# Altium project ESP32_Projet.PrjPcb
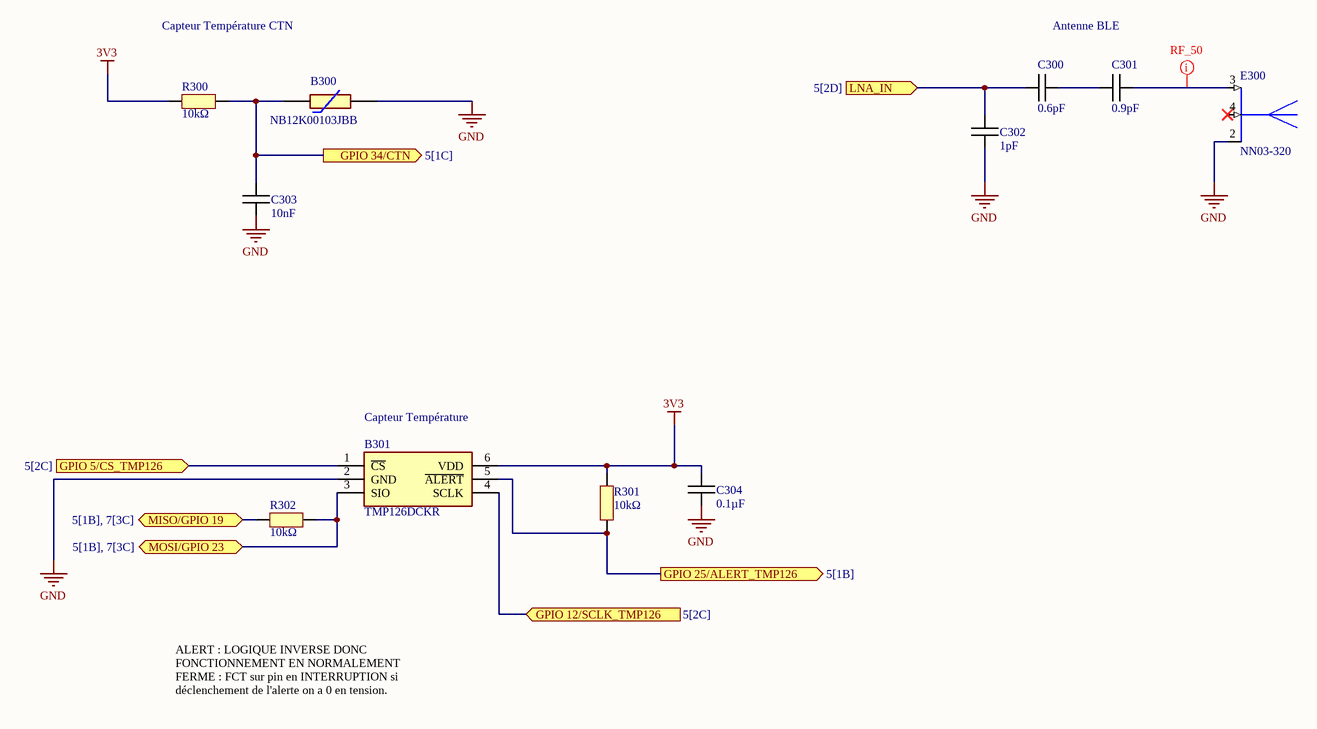
[diagram p0: Capteurs_et_Antenne.SchDoc]
7 sheets, 98 parts. Net scope: flat (ports and power ports of the same name join across sheets).
Board file: PCB_V_A_0.PcbDoc
Sheets:
  Capteurs_et_Antenne.SchDoc
  Converti_Alim.SchDoc
  Logique_Prio_Alim.SchDoc
  IHM.SchDoc
  ESP32_SRAM.SchDoc
  USB.SchDoc
  I2C.SchDoc

## Sheet Capteurs_et_Antenne.SchDoc: CAPTEURS ET ANTENNE BLUETOOTH
size A4; CheckedBy: P. FISCHER; Author: Y. NAIT et P. FISCHER; CompanyName: LE GROUPE DE 5; DrawnBy: Y. NAIT et P. FISCHER; DocumentNumber: SCH_CARTE_MONITORING_PERMANENT_0; Revision: A.0; SheetNumber: 3; SheetTotal: 7

### Parts
B300  NB12K00103JBB  [RESC2212X50N]
B301  TMP126DCKR  [SOT65P210X110-6N]
C300  0.6pF  [CAPC1005X06N]
C301  0.9pF  [CAPC1005X06N]
C302  1pF  [CAPC1005X06N]
C303  10nF  [CAPC1005X06N]
C304  0.1µF  [CAPC1005X06N]
E300  NN03-320  [XCVR_NN03-320]
R300  10kΩ  [RESC1005X06N]
R301  10kΩ  [RESC1005X06N]
R302  10kΩ  [RESC1005X06N]

### Ports
GPIO 5/CS_TMP126 (in, see 5[2C]), GPIO 12/SCLK_TMP126 (in, see 5[2C]), GPIO 25/ALERT_TMP126 (out, see 5[1B]), GPIO 34/CTN (out, see 5[1C]), LNA_IN (in, see 5[2D]), MISO/GPIO 19 (bidir, see 5[1B], 7[3C]), MOSI/GPIO 23 (bidir, see 5[1B], 7[3C])

### Nets
3V3: B301.6(VDD) C304.1 R300.1 R301.2
GND: B300.2 B301.2(GND) C302.1 C303.2 C304.2 E300.2(GROUND)
NetB300_1: B300.1 C303.1 R300.2 ; port GPIO 34/CTN
NetB301_1: B301.1(~{CS}) ; port GPIO 5/CS_TMP126
NetB301_3: B301.3(SIO) R302.2 ; port MOSI/GPIO 23
NetB301_4: B301.4(SCLK) ; port GPIO 12/SCLK_TMP126
NetB301_5: B301.5(~{ALERT}) R301.1 ; port GPIO 25/ALERT_TMP126
NetC300_1: C300.1 C301.1
NetC300_2: C300.2 C302.2 ; port LNA_IN
NetC301_2: C301.2 E300.3(FEED_BLUETOOTH)
NetJ700_5: R302.1 ; port MISO/GPIO 19

Not connected (* = marked no-connect by the designer): E300 4(FEED_GNSS)*

### Layout directives
rule Width Constraint [Pref Impedance = 50.00ohms    Min Impedance = 50.00ohms    Max Impedance = 50.00ohms]: NetC301_2

### Notes on the sheet
- Capteur Température CTN
- Antenne BLE
- (near B301) Capteur Température
- ALERT : LOGIQUE INVERSE DONC FONCTIONNEMENT EN NORMALEMENT FERME : FCT sur pin en INTERRUPTION si déclenchement de l'alerte on a 0 en tension.

### Library data of the parts
B300 = NB12K00103JBB: CTN Capteur - NTC SMD Thermistor, NB12K, 10K, 5% AVX 10k 0805 Protection NTC Thermistor, 5s, 2 x 1.25 x 1.3mm; Manufacturer_Name: Kyocera AVX; Geometry.Height: 0.5mm; Manufacturer_Part_Number: NB12K00103JBB; Mouser Part Number: 581-NB12K00103JBB; Mouser Price/Stock: https://www.mouser.co.uk/ProductDetail/AVX/NB12K00103JBB/?qs=4%252B6%252BTdINQeDPvI%252BQUQjJ3Q%3D%3D; Arrow Part Number: NB12K00103JBB; Arrow Price/Stock: https://www.arrow.com/en/products/nb12k00103jbb/avx; Datasheet Link: https://datasheet.datasheetarchive.com/originals/distributors/Datasheets-DGA6/551314.pdf
B301 = TMP126DCKR: Board Mount Temperature Sensors +/-0.25 C SPI temperature sensor with 175 C operation, CRC and slew-rate alert; Manufacturer_Name: Texas Instruments; Manufacturer_Part_Number: TMP126DCKR; Mouser Part Number: 595-TMP126DCKR
C300-C304 = Capacitor
E300 = NN03-320: Dual port antenna booster for GNSS, Bluetooth, 5G and UWB (1561 - 1606MHz, 2400 - 2500MHz, 3400 - 3800MHz, 3100 - 4800MHz and 6000 - 10600 MHz), signal booster; Manufacturer_Name: Ignion; Manufacturer_Part_Number: NN03-320; Mouser Part Number: 128-NN03-320
R300-R302 = Resistor

## Sheet Converti_Alim.SchDoc: CONVERSION DES ALIMENTATIONS D'ENTREES
size A4; Date: 26/04/2026; CheckedBy: P. FISCHER; Author: P. FISCHER; CompanyName: LE GROUPE DE 5; DrawnBy: P. FISCHER; DocumentNumber: SCH_CARTE_MONITORING_PERMANENT_0; Revision: A.0; SheetNumber: 1; SheetTotal: 7
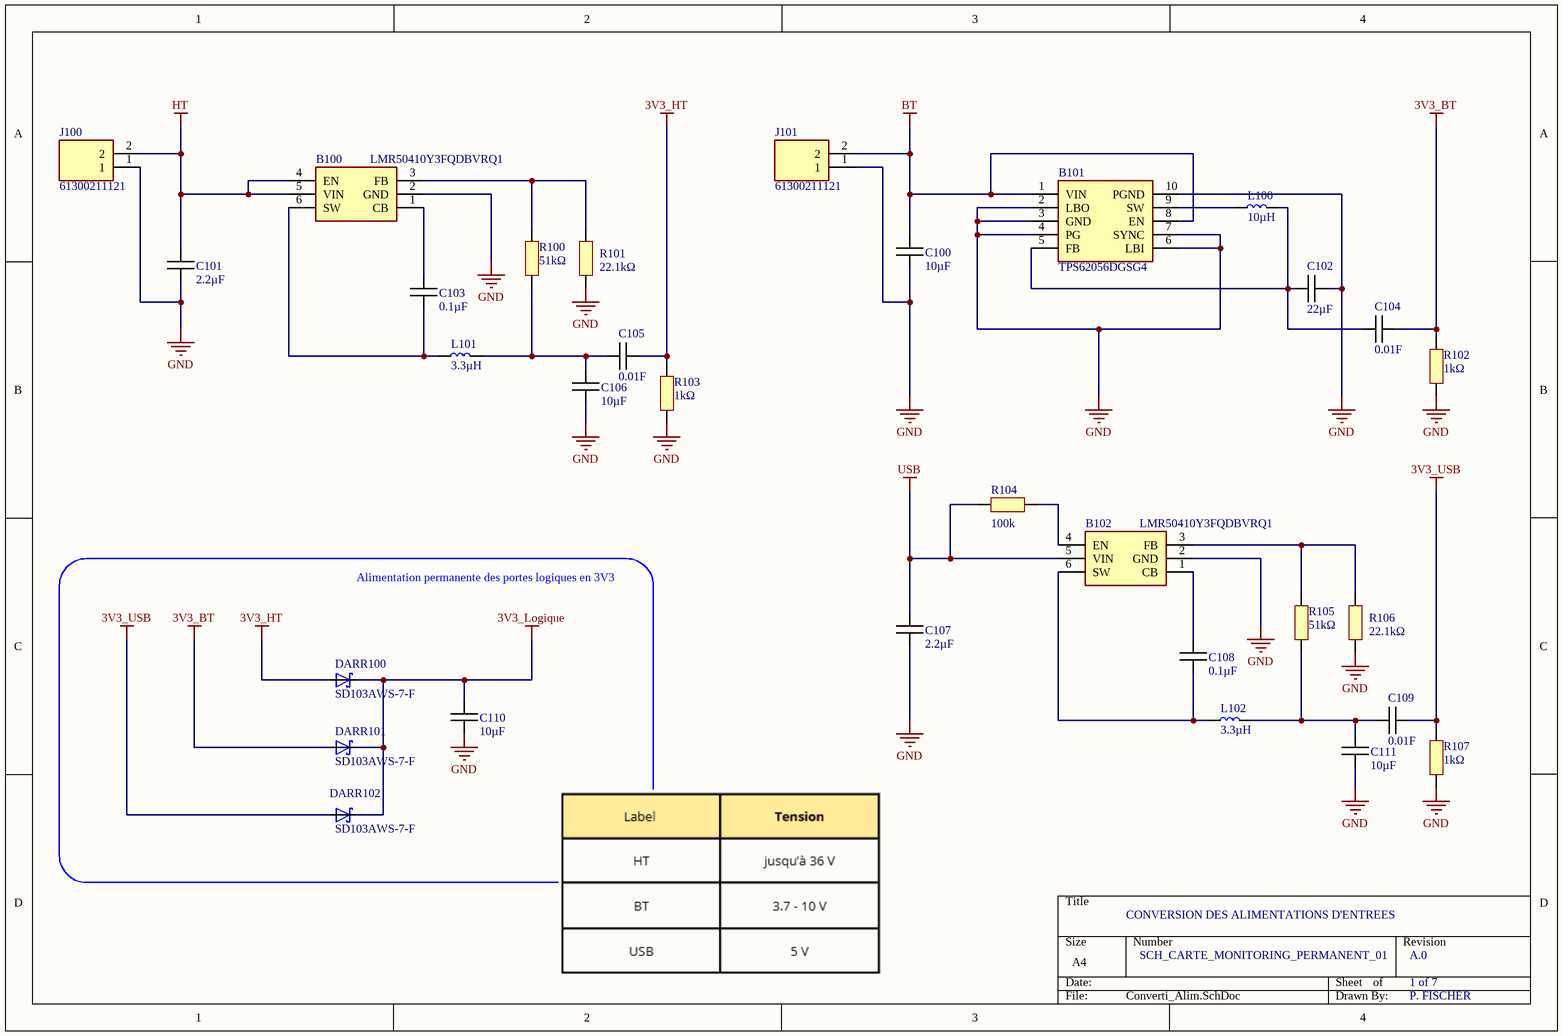
[diagram p1: Converti_Alim.SchDoc]

### Parts
B100  LMR50410Y3FQDBVRQ1  [SOT95P280X145-6N]
B101  TPS62056DGSG4  [SOP50P490X110-10N]
B102  LMR50410Y3FQDBVRQ1  [SOT95P280X145-6N]
C100  10µF  [CAPC1005X06N]
C101  2.2µF  [CAPC1005X06N]
C102  22µF  [CAPC1005X06N]
C103  0.1µF  [CAPC1005X06N]
C104  0.01F  [CAPC1005X06N]
C105  0.01F  [CAPC1005X06N]
C106  10µF  [CAPC1005X06N]
C107  2.2µF  [CAPC1005X06N]
C108  0.1µF  [CAPC1005X06N]
C109  0.01F  [CAPC1005X06N]
C110  10µF  [CAPC1005X06N]
C111  10µF  [CAPC1005X06N]
DARR100  SD103AWS-7-F  [SD103AWS-7-F]
DARR101  SD103AWS-7-F  [SD103AWS-7-F]
DARR102  SD103AWS-7-F  [SD103AWS-7-F]
J100  61300211121  [61300211121]
J101  61300211121  [61300211121]
L100  10µH  [LQPC1005X06N]
L101  3.3µH  [LQPC1005X06N]
L102  3.3µH  [LQPC1005X06N]
R100  51kΩ  [RESC1005X06N]
R101  22.1kΩ  [RESC1005X06N]
R102  1kΩ  [RESC1005X06N]
R103  1kΩ  [RESC1005X06N]
R104  100k  [RESC1005X06N]
R105  51kΩ  [RESC1005X06N]
R106  22.1kΩ  [RESC1005X06N]
R107  1kΩ  [RESC1005X06N]

### Blocks framed on the sheet
Alimentation permanente des portes logiques en 3V3: C110 DARR100-DARR102

### Nets
3V3_BT: C104.2 DARR101.2(A) R102.2
3V3_HT: C105.2 DARR100.2(A) R103.2
3V3_Logique: C110.1 DARR100.1(C) DARR101.1(C) DARR102.1(C)
3V3_USB: C109.2 DARR102.2(A) R107.2
BT: B101.1(VIN) B101.8(EN) C100.1 J101.2
GND: B100.2(GND) B101.2(LBO) B101.3(GND) B101.4(PG) B101.6(LBI) B101.7(SYNC) B101.10(PGND) B102.2(GND) C100.2 C101.2 C102.2 C106.2 C107.2 C110.2 C111.2 J100.1 J101.1 R101.1 R102.1 R103.1 R106.1 R107.1
HT: B100.4(EN) B100.5(VIN) C101.1 J100.2
USB: B102.5(VIN) C107.1 R104.1
NetB100_1: B100.1(CB) C103.1
NetB100_3: B100.3(FB) R100.2 R101.2
NetB100_6: B100.6(SW) C103.2 L101.1
NetB101_5: B101.5(FB) C102.1 C104.1 L100.2
NetB101_9: B101.9(SW) L100.1
NetB102_1: B102.1(CB) C108.1
NetB102_3: B102.3(FB) R105.2 R106.2
NetB102_4: B102.4(EN) R104.2
NetB102_6: B102.6(SW) C108.2 L102.1
NetC105_1: C105.1 C106.1 L101.2 R100.1
NetC109_1: C109.1 C111.1 L102.2 R105.1

### Library data of the parts
B100 B102 = LMR50410Y3FQDBVRQ1: Régulateurs de tension de commutation Automotive qualified SIMPLE SWITCHER 4-V to 36-V, 1-A synchronous step-down converter 6-SOT-23 -40 to 150; Manufacturer_Name: Texas Instruments; Manufacturer_Part_Number: LMR50410Y3FQDBVRQ1; Mouser Part Number: 595-R50410Y3FQDBVRQ1
B101 = TPS62056DGSG4: TEXAS INSTRUMENTS - TPS62056DGSG4 - Synchronous Buck (Step Down) Switching Regulator, Fixed, 2.7V-10Vin, 3.3V/0.8A out, 850kHz, VSSOP-10; Manufacturer_Name: Texas Instruments; Manufacturer_Part_Number: TPS62056DGSG4; Mouser Part Number: 595-TPS62056DGSG4
C100-C111 = Capacitor
DARR100-DARR102 = SD103AWS-7-F: Diode Array 3 Independent Schottky 40V 175mA Surface Mount 6-TSSOP, SC-88, SOT-363
J100 J101 = 61300211121: WURTH ELEKTRONIK - 61300211121 - HEADER, 2.54MM, PIN, THT, VERTICAL, 2WAY
L100-L102 = Bobine
R100-R107 = Resistor

## Sheet Logique_Prio_Alim.SchDoc: LOGIQUE DE GESTION DES PRIORITES DES ALIMENTATIONS
size A4; Date: 14/04/2026; CheckedBy: P. FISCHER; Author: P. FISCHER; CompanyName: LE GROUPE DE 5; DrawnBy: P. FISCHER; DocumentNumber: SCH_CARTE_MONITORING_PERMANENT_0; Revision: A.0; SheetNumber: 2; SheetTotal: 7
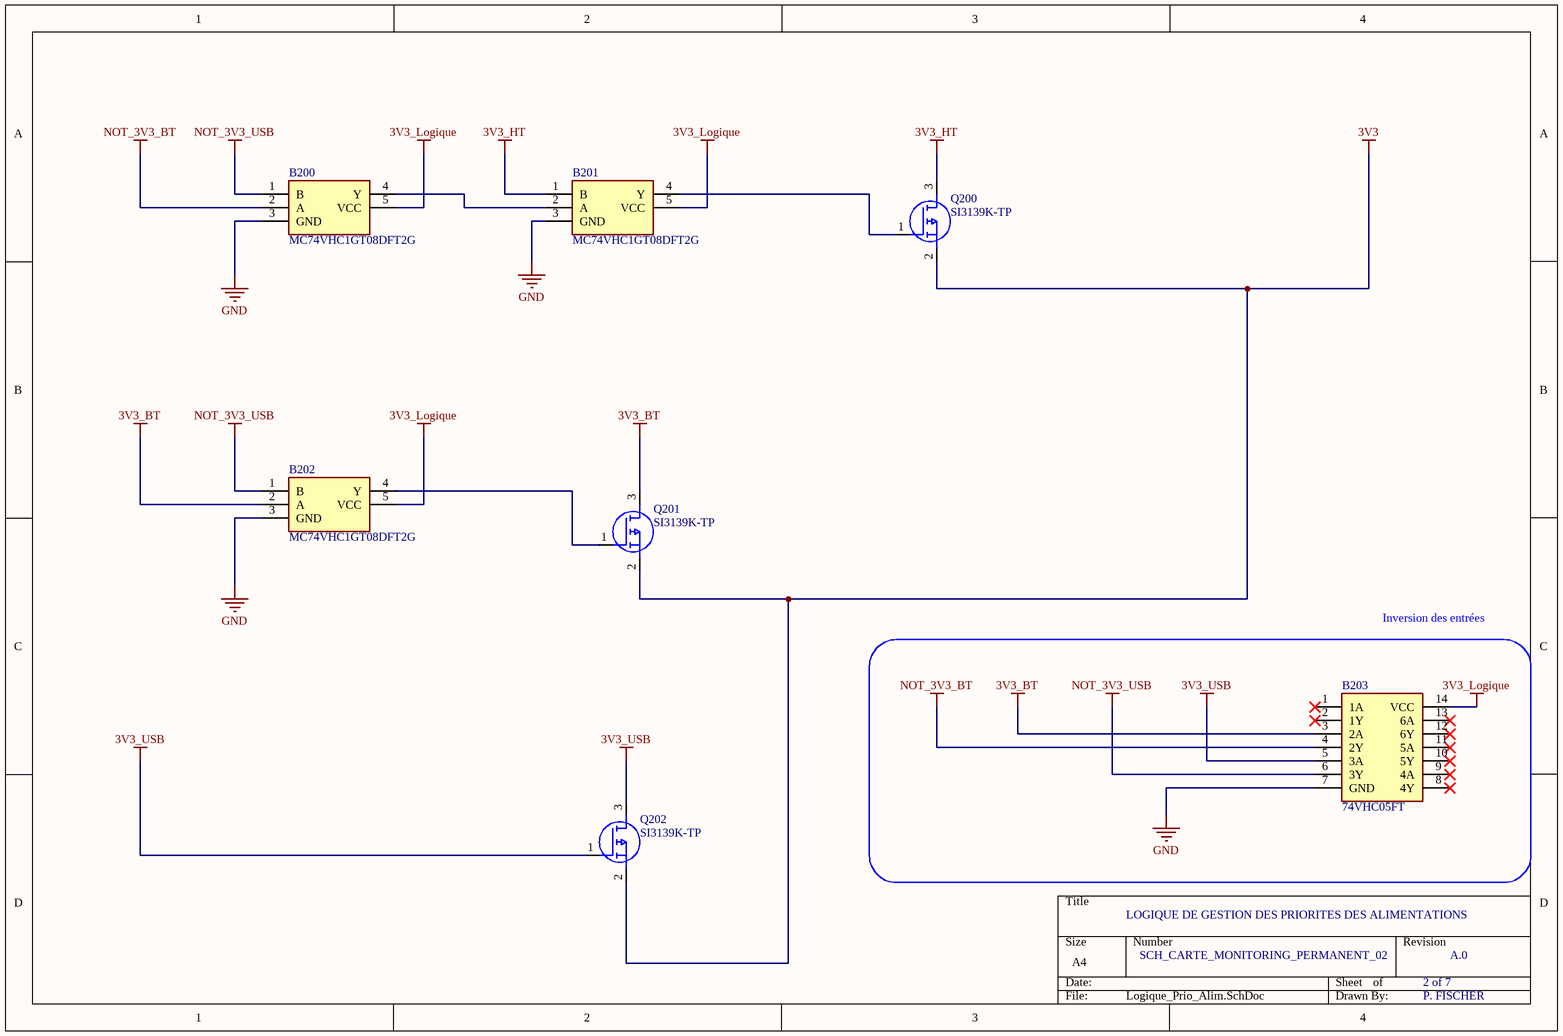
[diagram p2: Logique_Prio_Alim.SchDoc]

### Parts
B200  MC74VHC1GT08DFT2G  [SOT65P210X110-5N]
B201  MC74VHC1GT08DFT2G  [SOT65P210X110-5N]
B202  MC74VHC1GT08DFT2G  [SOT65P210X110-5N]
B203  74VHC05FT  [SOP65P640X120-14N]
Q200  SI3139K-TP  [SI3139K-TP]
Q201  SI3139K-TP  [SI3139K-TP]
Q202  SI3139K-TP  [SI3139K-TP]

### Blocks framed on the sheet
Inversion des entrées: B203

### Nets
3V3: Q200.2(S) Q201.2(S) Q202.2(S)
3V3_BT: B202.2(A) B203.3(2A) Q201.3(D)
3V3_HT: B201.1(B) Q200.3(D)
3V3_Logique: B200.5(VCC) B201.5(VCC) B202.5(VCC) B203.14(VCC)
3V3_USB: B203.5(3A) Q202.1(G) Q202.3(D)
GND: B200.3(GND) B201.3(GND) B202.3(GND) B203.7(GND)
NOT_3V3_BT: B200.2(A) B203.4(2Y)
NOT_3V3_USB: B200.1(B) B202.1(B) B203.6(3Y)
NetB200_4: B200.4(Y) B201.2(A)
NetB201_4: B201.4(Y) Q200.1(G)
NetB202_4: B202.4(Y) Q201.1(G)

Not connected (* = marked no-connect by the designer): B203 1(1A)* 2(1Y)* 8(4Y)* 9(4A)* 10(5Y)* 11(5A)* 12(6Y)* 13(6A)*

### Library data of the parts
B200-B202 = MC74VHC1GT08DFT2G: Single 2-Input AND Gate, TTL Level; Manufacturer_Name: onsemi; Manufacturer_Part_Number: MC74VHC1GT08DFT2G; Parameter 3: *
B203 = 74VHC05FT: Logic Gates CMOS LOGIC IC INVERTER; Manufacturer_Name: Toshiba; Manufacturer_Part_Number: 74VHC05FT; Mouser Part Number: 757-74VHC05FT
Q200-Q202 = SI3139K-TP: MOSFET P-Channel MOSFET

## Sheet IHM.SchDoc: ENTREES ET SORTIES IHM
size A4; CheckedBy: P. FISCHER; Author: P. FISCHER; CompanyName: LE GROUPE DE 5; DrawnBy: Y. NAIT et P. FISCHER; DocumentNumber: SCH_CARTE_MONITORING_PERMANENT_0; Revision: A.0; SheetNumber: 4; SheetTotal: 7
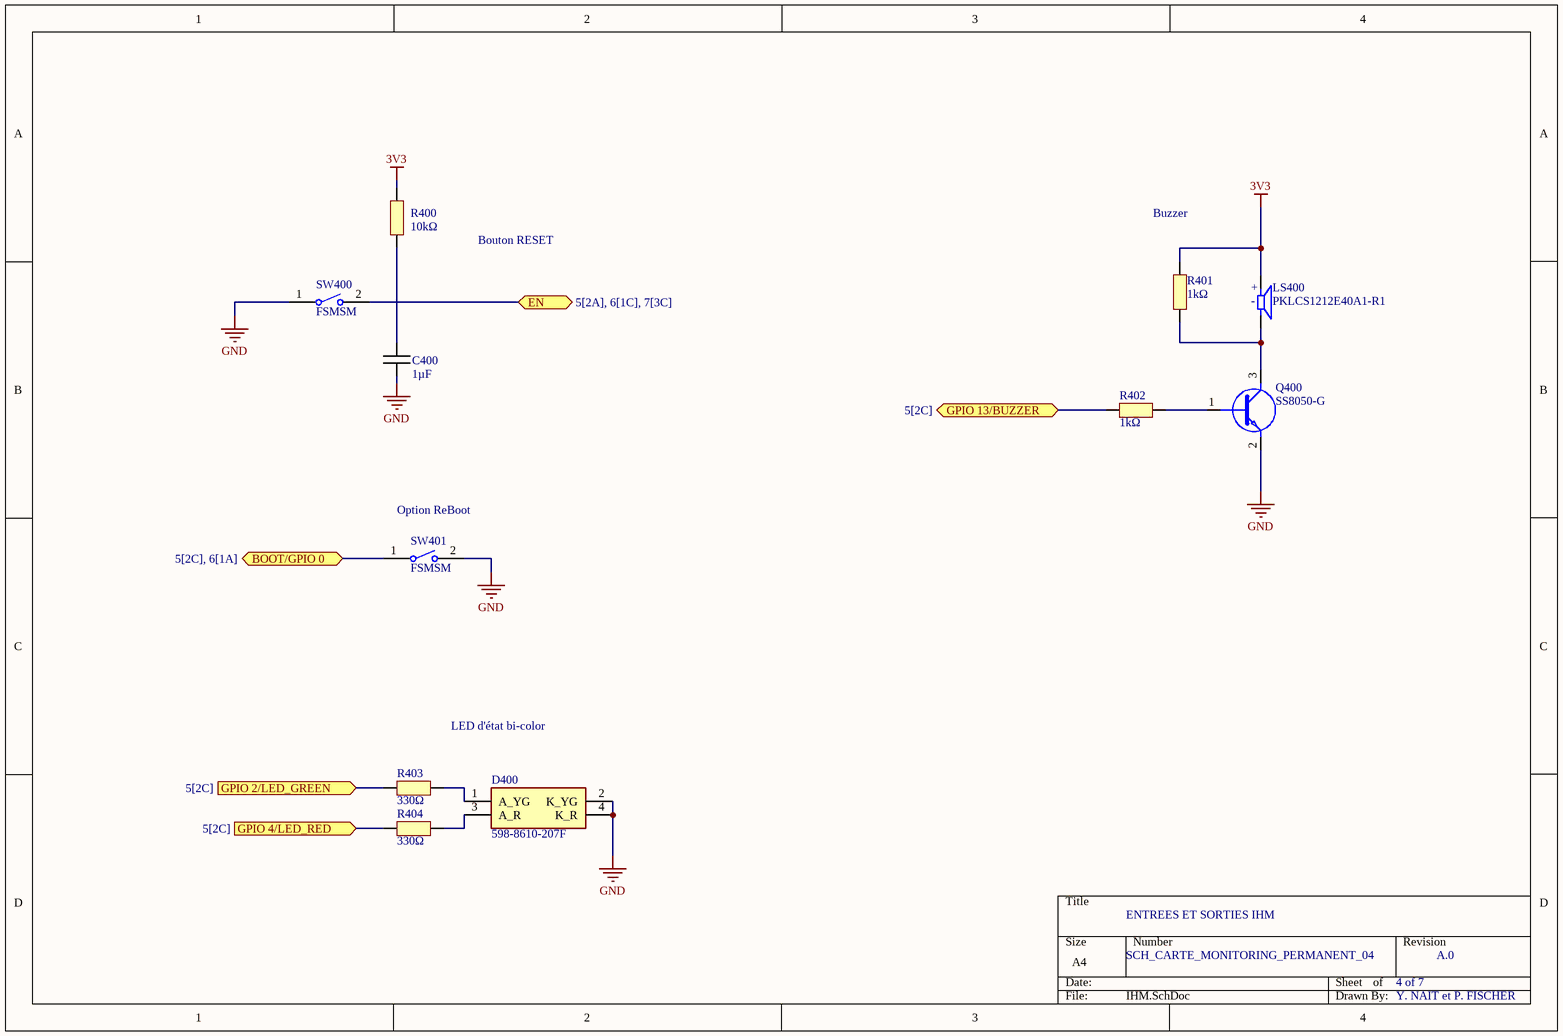
[diagram p3: IHM.SchDoc]

### Parts
C400  1µF  [CAPC1005X06N]
D400  598-8610-207F  [5988610207F]
LS400  PKLCS1212E40A1-R1  [SPKR_PKLCS1212E40A1-R1]
Q400  SS8050-G  [SS8050-G]
R400  10kΩ  [RESC1005X06N]
R401  1kΩ  [RESC1005X06N]
R402  1kΩ  [RESC1005X06N]
R403  330Ω  [RESC1005X06N]
R404  330Ω  [RESC1005X06N]
SW400  FSMSM  [TECO-FSMSM-2_V]
SW401  FSMSM  [TECO-FSMSM-2_V]

### Ports
BOOT/GPIO 0 (bidir, see 5[2C], 6[1A]), EN (bidir, see 5[2A], 6[1C], 7[3C]), GPIO 2/LED_GREEN (in, see 5[2C]), GPIO 4/LED_RED (in, see 5[2C]), GPIO 13/BUZZER (bidir, see 5[2C])

### Nets
3V3: LS400.P R400.2 R401.2
GND: C400.2 D400.2(K_YG) D400.4(K_R) Q400.2(E) SW400.1 SW401.2
NetC400_1: C400.1 R400.1
NetD400_1: D400.1(A_YG) R403.2
NetD400_3: D400.3(A_R) R404.2
NetJ700_2: SW400.2 ; port EN
NetLS400_N: LS400.N Q400.3(C) R401.1
NetQ400_1: Q400.1(B) R402.2
NetQ600_3: SW401.1 ; port BOOT/GPIO 0
NetR402_1: R402.1 ; port GPIO 13/BUZZER
NetR403_1: R403.1 ; port GPIO 2/LED_GREEN
NetR404_1: R404.1 ; port GPIO 4/LED_RED

### Notes on the sheet
- Bouton RESET
- Buzzer
- (near SW401) Option ReBoot
- LED d'état bi-color
- (in symbol PKLCS1212E40A1-R1) +; -

### Library data of the parts
C400 = Capacitor
D400 = 598-8610-207F: Standard LEDs - SMD Red/Green WC 80/50mcd 645/570nm; Manufacturer_Name: Dialight; Geometry.Height: 0.8mm; Manufacturer_Part_Number: 598-8610-207F; Mouser Part Number: 645-598-8610-207F; Mouser Price/Stock: https://www.mouser.co.uk/ProductDetail/Dialight/598-8610-207F?qs=7JStj%2FjQ2SFuCjosqwklHQ%3D%3D; Arrow Part Number: 598-8610-207F; Arrow Price/Stock: https://www.arrow.com/en/products/598-8610-207f/dialight?region=nac; Datasheet Link: https://media.digikey.com/pdf/Data%20Sheets/Dialight%20PDFs/598%20Series%201210%20Pkg%20Bi-Color.pdf
LS400 = PKLCS1212E40A1-R1: Buzzers Transducer, Externally Driven Piezo 1.5V 2kHz 70dB @ 1.5V, 10cm Surface Mount Solder Pads; MF: Murata Electronics; Value: *; MP: PKLCS1212E40A1-R1; Package: None; Availability: Unavailable; Price: None
Q400 = SS8050-G: Bipolar Transistors - BJT NPN TRANSISTOR 1.5A 40V
R400-R404 = Resistor
SW400 SW401 = CMP-2000-07511-1: FSMSM Push Button Switch, 50 mA, -35 to 85 degC, 2-Pin SMD, RoHS, Bulk; Manufacturer: TE Connectivity; Actuator Length: 1.07mm; Electrical Life: 20000Cycles; Actuator Material: Polyamide; Current Rating: 50mA; Illumination Type: Illuminated; Voltage Rating (DC): 24V; Contact Resistance: 100mOhm; Case\/Package: SMD/SMT; Operating Force: 180gf; Switch Travel: 0.25mm; Max Voltage Rating (DC): 12V; Throw Configuration: SPST; Packaging: LoosePiece; Max Operating Temperature: 85degC; ELV: Compliant; Package Description: 2-Pin Surface Mount Device, Body 6 x 3.5 mm, Pitch 9.19 mm; RoHSCompliant: true; Manufacturer URL: http://www.te.com/; Contact Plating: Silver; Contact Material: Brass; Mounting Technology: SurfaceMount; Contact Current Rating: 50mA; Datasheet Version: Rev. C2, 08/2014; Datasheet URL: http://www.te.com/commerce/DocumentDelivery/DDEController?Action=showdoc&DocId=Customer+Drawing%7F1437566-3%7FC2%7Fpdf%7FEnglish%7FENG_CD_1437566-3_C2_1437566_3_1_c.dwg.pdf%7F1437566-3; Mechanical Life: 20000Cycles; Package Reference: FSMSM; REACH SVHC: Unknown; Orientation: Straight; Min Operating Temperature: -35degC; Lead Free: LeadFree; Termination: GullWing; Package Quantity: 1000; Mount: SurfaceMount

## Sheet ESP32_SRAM.SchDoc: ESP32 et ENREGISTREMENT DES EVENEMENTS
size A4; CheckedBy: P. FISCHER; Author: A. LANDREAU et P. FISCHER; CompanyName: LE GROUPE DE 5; DrawnBy: A. LANDREAU et P. FISCHER; DocumentNumber: SCH_CARTE_MONITORING_PERMANENT_0; Revision: A.0; SheetNumber: 5; SheetTotal: 7
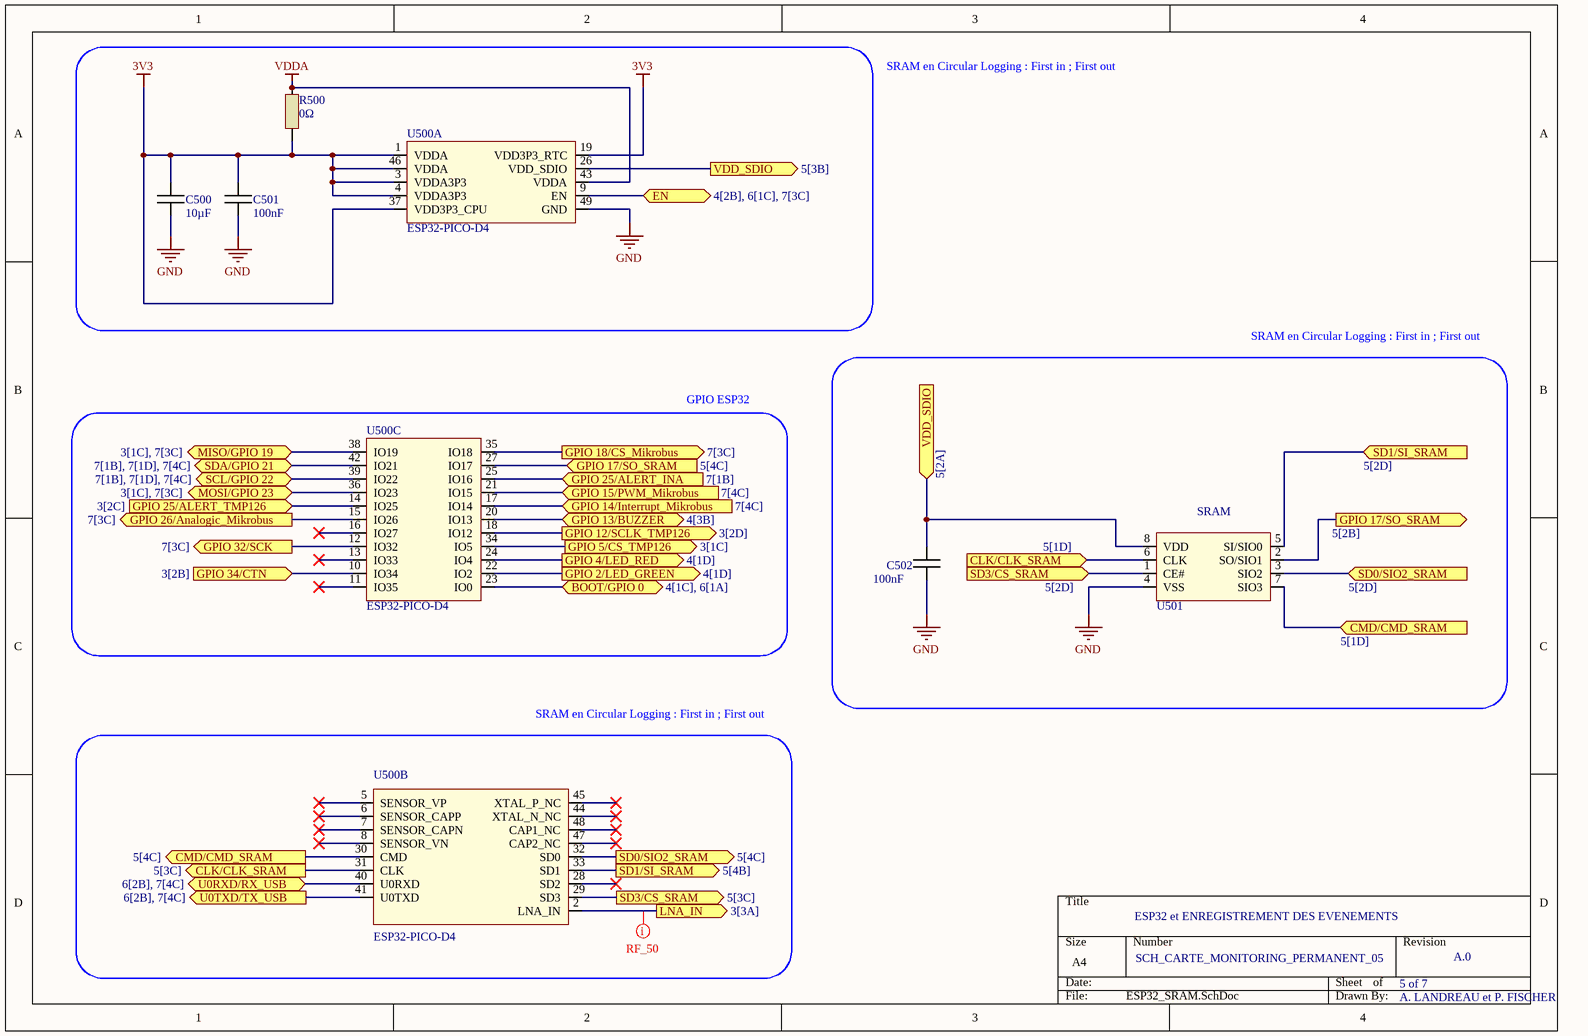
[diagram p4: ESP32_SRAM.SchDoc]

### Parts
C500  10µF  [CAPC1005X06N]
C501  100nF  [CAPC1005X06N]
C502  100nF  [CAPC1005X06N]
R500  0Ω  [RESC1005X06N]
U500  ESP32-PICO-D4  [PQFN50P700X700X104_HS-49N]  (parts A,B,C of 3)
U501  IS66WVS1M8BLL-104NLI  [SOIC127P600X175-8N]  (value not drawn)

### Blocks framed on the sheet
GPIO ESP32: U500
SRAM en Circular Logging : First in ; First out: U500

### Ports
BOOT/GPIO 0 (bidir, see 4[1C], 6[1A]), CLK/CLK_SRAM (in, see 5[1D]), CLK/CLK_SRAM (out, see 5[3C]), CMD/CMD_SRAM (in, see 5[1D]), CMD/CMD_SRAM (out, see 5[4C]), EN (bidir, see 4[2B], 6[1C], 7[3C]), GPIO 2/LED_GREEN (out, see 4[1D]), GPIO 4/LED_RED (out, see 4[1D]), GPIO 5/CS_TMP126 (out, see 3[1C]), GPIO 12/SCLK_TMP126 (out, see 3[2D]), GPIO 13/BUZZER (bidir, see 4[3B]), GPIO 14/Interrupt_Mikrobus (in, see 7[4C]), GPIO 15/PWM_Mikrobus (in, see 7[4C]), GPIO 17/SO_SRAM (in, see 5[4C]), GPIO 17/SO_SRAM (out, see 5[2B]), GPIO 18/CS_Mikrobus (out, see 7[3C]), GPIO 25/ALERT_INA (in, see 7[1B]), GPIO 25/ALERT_TMP126 (in, see 3[2C]), GPIO 26/Analogic_Mikrobus (out, see 7[3C]), GPIO 32/SCK (out, see 7[3C]), GPIO 34/CTN (in, see 3[2B]), LNA_IN (out, see 3[3A]), MISO/GPIO 19 (bidir, see 3[1C], 7[3C]), MOSI/GPIO 23 (bidir, see 3[1C], 7[3C]), SCL/GPIO 22 (bidir, see 7[1B], 7[1D], 7[4C]), SD0/SIO2_SRAM (in, see 5[2D]), SD0/SIO2_SRAM (out, see 5[4C]), SD1/SI_SRAM (in, see 5[2D]), SD1/SI_SRAM (out, see 5[4B]), SD3/CS_SRAM (in, see 5[2D]), SD3/CS_SRAM (out, see 5[3C]), SDA/GPIO 21 (bidir, see 7[1B], 7[1D], 7[4C]), U0RXD/RX_USB (bidir, see 6[2B], 7[4C]), U0TXD/TX_USB (out, see 6[2B], 7[4C]), VDD_SDIO (in, see 5[2A]), VDD_SDIO (out, see 5[3B])

### Nets
3V3: C500.1 C501.1 R500.1 U500.1(VDDA) U500.3(VDDA3P3) U500.4(VDDA3P3) U500.19(VDD3P3_RTC) U500.37(VDD3P3_CPU) U500.46(VDDA)
GND: C500.2 C501.2 C502.2 U500.49(GND) U501.4(VSS)
VDDA: R500.2 U500.43(VDDA)
NetB300_1: U500.10(IO34) ; port GPIO 34/CTN
NetB301_1: U500.34(IO5) ; port GPIO 5/CS_TMP126
NetB301_3: U500.36(IO23) ; port MOSI/GPIO 23
NetB301_4: U500.18(IO12) ; port GPIO 12/SCLK_TMP126
NetB301_5: U500.14(IO25) ; port GPIO 25/ALERT_TMP126
NetB700_3: U500.25(IO16) ; port GPIO 25/ALERT_INA
NetB700_4: U500.42(IO21) ; port SDA/GPIO 21
NetB700_5: U500.39(IO22) ; port SCL/GPIO 22
NetC300_2: U500.2(LNA_IN) ; port LNA_IN
NetC502_1: C502.1 U500.26(VDD_SDIO) U501.8(VDD) ; port VDD_SDIO
NetJ700_1: U500.15(IO26) ; port GPIO 26/Analogic_Mikrobus
NetJ700_2: U500.9(EN) ; port EN
NetJ700_3: U500.35(IO18) ; port GPIO 18/CS_Mikrobus
NetJ700_4: U500.12(IO32) ; port GPIO 32/SCK
NetJ700_5: U500.38(IO19) ; port MISO/GPIO 19
NetJ700_9: U500.21(IO15) ; port GPIO 15/PWM_Mikrobus
NetJ700_10: U500.17(IO14) ; port GPIO 14/Interrupt_Mikrobus
NetJ700_11: U500.40(U0RXD) ; port U0RXD/RX_USB
NetJ700_12: U500.41(U0TXD) ; port U0TXD/TX_USB
NetQ600_3: U500.23(IO0) ; port BOOT/GPIO 0
NetR402_1: U500.20(IO13) ; port GPIO 13/BUZZER
NetR403_1: U500.22(IO2) ; port GPIO 2/LED_GREEN
NetR404_1: U500.24(IO4) ; port GPIO 4/LED_RED
NetU500_27: U500.27(IO17) U501.2(SO/SIO1) ; port GPIO 17/SO_SRAM
NetU500_29: U500.29(SD3) U501.1(CE#) ; port SD3/CS_SRAM
NetU500_30: U500.30(CMD) U501.7(SIO3) ; port CMD/CMD_SRAM
NetU500_31: U500.31(CLK) U501.6(CLK) ; port CLK/CLK_SRAM
NetU500_32: U500.32(SD0) U501.3(SIO2) ; port SD0/SIO2_SRAM
NetU500_33: U500.33(SD1) U501.5(SI/SIO0) ; port SD1/SI_SRAM

Not connected (* = marked no-connect by the designer): U500 5(SENSOR_VP)* 6(SENSOR_CAPP)* 7(SENSOR_CAPN)* 8(SENSOR_VN)* 11(IO35)* 13(IO33)* 16(IO27)* 28(SD2)* 44(XTAL_N_NC)* 45(XTAL_P_NC)* 47(CAP2_NC)* 48(CAP1_NC)*

### Layout directives
rule Width Constraint [Pref Impedance = 50.00ohms    Min Impedance = 50.00ohms    Max Impedance = 50.00ohms]: NetC300_2

### Notes on the sheet
- SRAM en Circular Logging : First in ; First out
- (near U501) SRAM

### Library data of the parts
C500-C502 = Capacitor
R500 = Resistor
U500 = ESP32: Système RF sur puce - SoC SIP module ESP32 with 4MByte Flash, Dual Core MCU, Wi-Fi & Bluetooth Combo, LGA48-pin, 7*7mm; Manufacturer 1: Espressif Systems; Supplier 1: Digi-Key; Supplier Part Number 1: 1904-1029-1-ND; Manufacturer Part Number 1: ESP32-PICO-D4
U501 = SRAM: SRAM 8Mb, SerialRAM, 2.7V-3.6V, 104MHz, 8 pin SOIC 150 mil, RoHS; Manufacturer 1: ISSI; Supplier 1: Digi-Key; Supplier Part Number 1: 706-IS66WVS1M8BLL-104NLI-ND; Manufactuer Part Number 1: IS66WVS1M8BLL-104NLI

## Sheet USB.SchDoc: GESTION USB / UART
size A4; CheckedBy: P. FISCHER; Author: A. LANDREAU; CompanyName: LE GROUPE DE 5; DrawnBy: A. LANDREAU et P. FISCHER; DocumentNumber: SCH_CARTE_MONITORING_PERMANENT_0; Revision: A.0; SheetNumber: 6; SheetTotal: 7
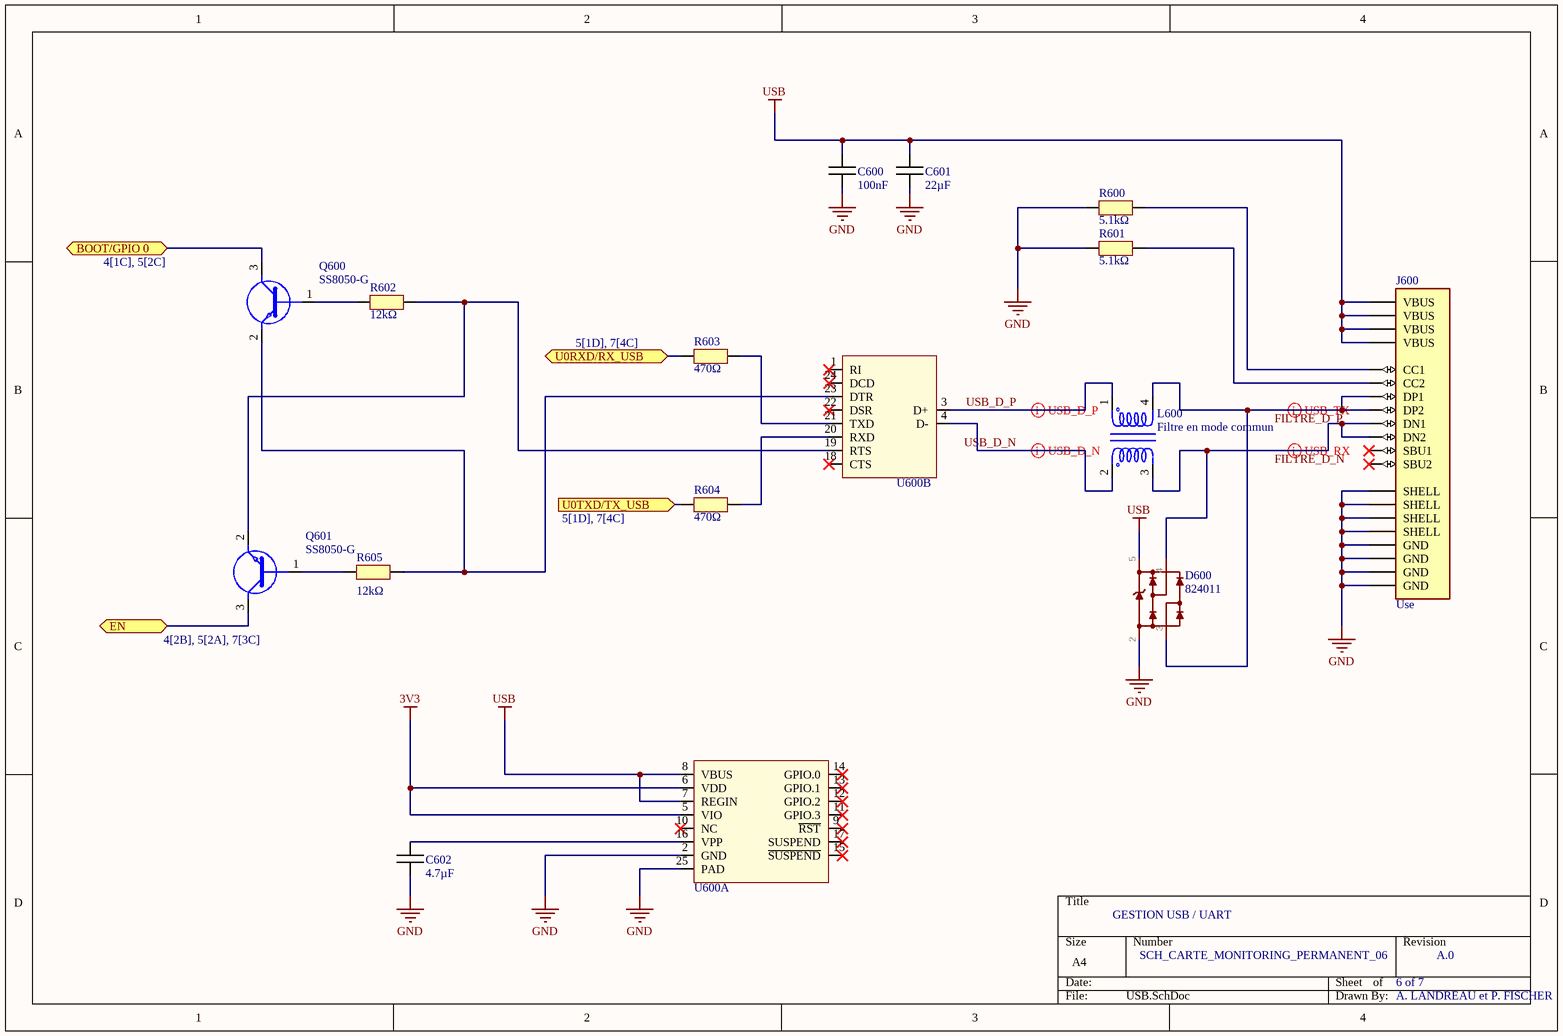
[diagram p5: USB.SchDoc]

### Parts
C600  100nF  [CAPC1005X06N]
C601  22µF  [CAPC1005X06N]
C602  4.7µF  [CAPC1005X06N]
D600  824011  [824011]
J600  Use  [USB4085-GF-A]
L600  Filtre en mode commun  [744232090]
Q600  SS8050-G  [SS8050-G]
Q601  SS8050-G  [SS8050-G]
R600  5.1kΩ  [RESC1005X06N]
R601  5.1kΩ  [RESC1005X06N]
R602  12kΩ  [RESC1005X06N]
R603  470Ω  [RESC1005X06N]
R604  470Ω  [RESC1005X06N]
R605  12kΩ  [RESC1005X06N]
U600  CP2104-F03-GM  [PQFN50P400X400X80_HS-25N]  (value not drawn)  (parts A,B of 2)

### Ports
BOOT/GPIO 0 (bidir, see 4[1C], 5[2C]), EN (bidir, see 4[2B], 5[2A], 7[3C]), U0RXD/RX_USB (bidir, see 5[1D], 7[4C]), U0TXD/TX_USB (in, see 5[1D], 7[4C])

### Nets
3V3: U600.5(VIO) U600.6(VDD)
GND: C600.2 C601.2 C602.2 D600.2(GND) J600.A1(GND) J600.A12(GND) J600.B1(GND) J600.B12(GND) J600.S1(SHELL) J600.S2(SHELL) J600.S3(SHELL) J600.S4(SHELL) R600.1 R601.1 U600.2(GND) U600.25(PAD)
USB: C600.1 C601.1 D600.5(VDD) J600.A4(VBUS) J600.A9(VBUS) J600.B4(VBUS) J600.B9(VBUS) U600.7(REGIN) U600.8(VBUS)
FILTRE_D_N: D600.4 J600.A7(DN1) J600.B7(DN2) L600.3  [project net FILTRE_D_N_6]
FILTRE_D_P: D600.3 J600.A6(DP1) J600.B6(DP2) L600.4  [project net FILTRE_D_P_6]
USB_D_N: L600.2 U600.4(D-)  [project net USB_D_N_6]
USB_D_P: L600.1 U600.3(D+)  [project net USB_D_P_6]
NetC602_1: C602.1 U600.16(VPP)
NetJ600_A5: J600.A5(CC1) R600.2
NetJ600_B5: J600.B5(CC2) R601.2
NetJ700_2: Q601.3(C) ; port EN
NetJ700_11: R603.1 ; port U0RXD/RX_USB
NetJ700_12: R604.1 ; port U0TXD/TX_USB
NetQ600_1: Q600.1(B) R602.1
NetQ600_2: Q600.2(E) R605.2 U600.23(DTR)
NetQ600_3: Q600.3(C) ; port BOOT/GPIO 0
NetQ601_1: Q601.1(B) R605.1
NetQ601_2: Q601.2(E) R602.2 U600.19(RTS)
NetR603_2: R603.2 U600.21(TXD)
NetR604_2: R604.2 U600.20(RXD)

Not connected (* = marked no-connect by the designer): J600 A8(SBU1)* B8(SBU2)*; U600 1(RI)* 9(~{RST})* 10(NC)* 11(GPIO.3)* 12(GPIO.2)* 13(GPIO.1)* 14(GPIO.0)* 15(~{SUSPEND})* 17(SUSPEND)* 18(CTS)* 22(DSR)* 24(DCD)*

### Layout directives
differential pair; rule Differential Pairs Routing [Pref Gap = 0.127mm    Min Gap  = 0.127mm    Max Gap  = 0.127mmPref Width = 0.303mm    Min Width  = 0.109mm    Max Width  = 0.303mm]: FILTRE_D_N_6, FILTRE_D_P_6, USB_D_N_6, USB_D_P_6

### Library data of the parts
C600-C602 = Capacitor
D600 = 824011: TVS Diode Array WE-TVS, High Speed Series  - Low capazity - No leakage current - Low clamping voltage - high ESD voltage protection  -- USB 1.0 - 2.0
J600 = USB4085-GF-A: Connecteurs USB USB Type C, 2.0, Rec, TH , G/F, RA , Top Mnt, T & R
L600 = 744232090: Bobines / filtres en mode commun WE-CNSW 1206 370mA 90Ohm 100MHz AECQ200
Q600 Q601 = SS8050-G: as Q400 on sheet IHM
R600-R605 = Resistor
U600 = USBBridge: USB Bridge, USB to UART USB 2.0 UART Interface 24-QFN (4x4); Manufacturer 1: Silicon Labs; Supplier 1: Arrow Electronics; Supplier Part Number 1: CP2104-F03-GM; Manufacturer Part Number 1: CP2104-F03-GM

## Sheet I2C.SchDoc: COMMUNICATION I2C
size A4; CheckedBy: P. FISCHER; Author: J-E GBAYEWO; CompanyName: LE GROUPE DE 5; DrawnBy: J-E GBAYEWO; DocumentNumber: SCH_CARTE_MONITORING_PERMANENT_0; Revision: A.0; SheetNumber: 7; SheetTotal: 7
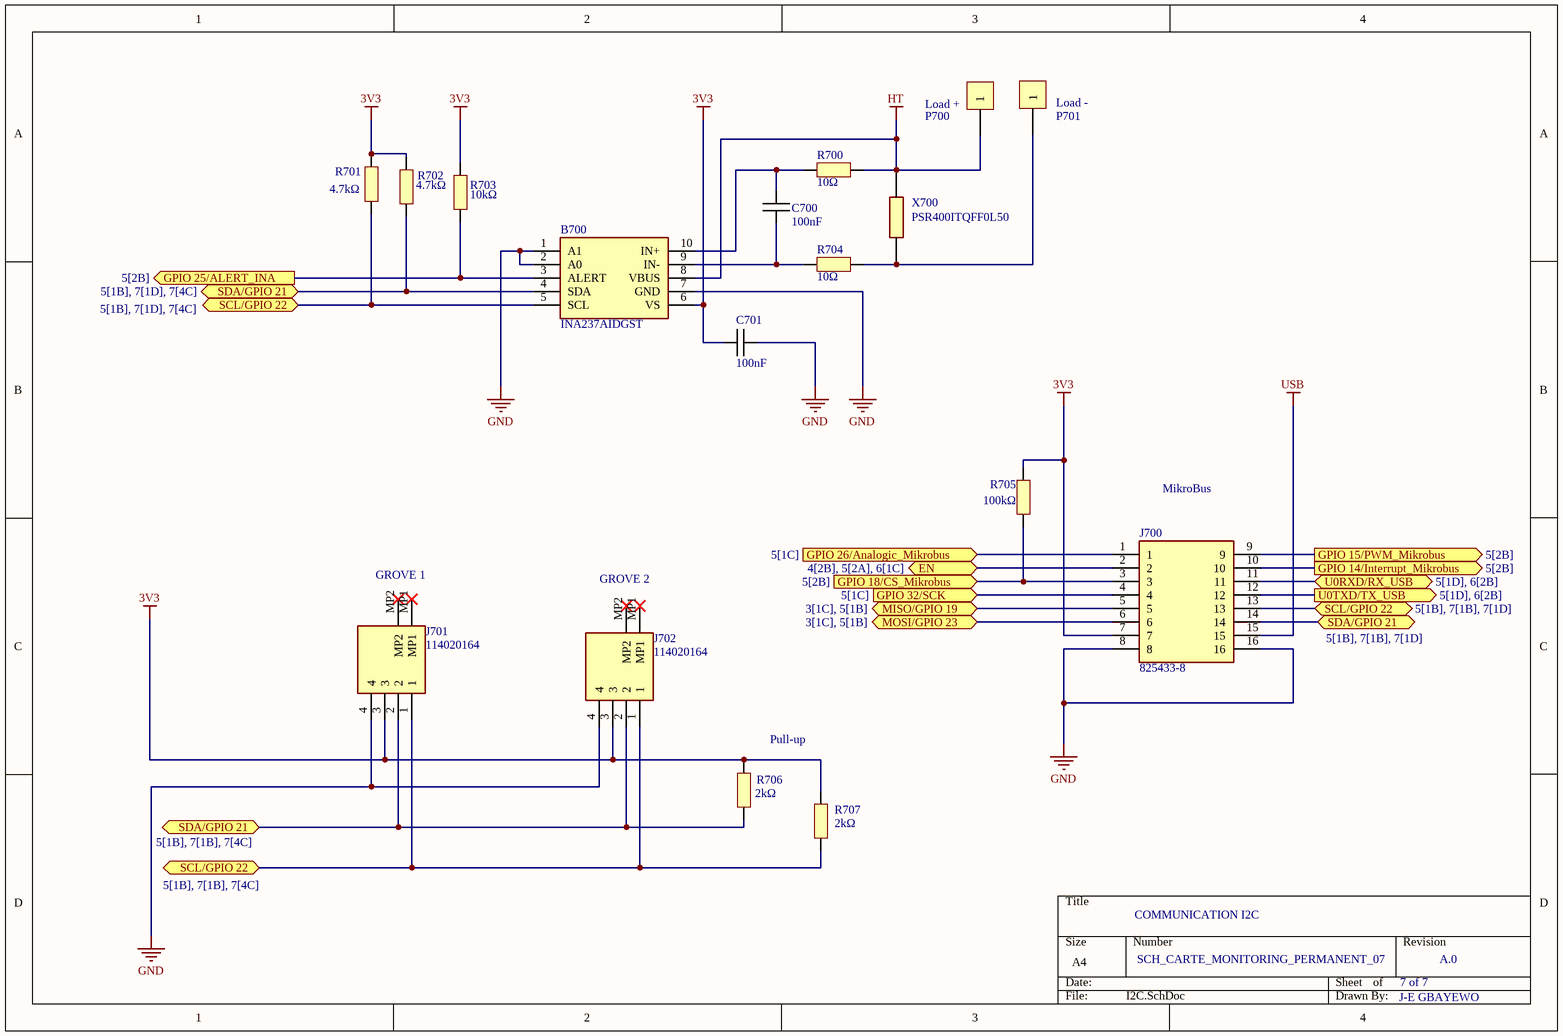
[diagram p6: I2C.SchDoc]

### Parts
B700  INA237AIDGST  [SOP50P490X110-10N]
C700  100nF  [CAPC1005X06N]
C701  100nF  [CAPC1005X06N]
J700  825433-8  [Connect-Mikrobus]
J701  114020164  [114020164]
J702  114020164  [114020164]
P700  Plage CMS 10x5  [Plage CMS 10x5]  (value not drawn)  (no BOM)
P701  Plage CMS 10x5  [Plage CMS 10x5]  (value not drawn)  (no BOM)
R700  10Ω  [RESC1005X06N]
R701  4.7kΩ  [RESC1005X06N]
R702  4.7kΩ  [RESC1005X06N]
R703  10kΩ  [RESC1005X06N]
R704  10Ω  [RESC1005X06N]
R705  100kΩ  [RESC1005X06N]
R706  2kΩ  [RESC1005X06N]
R707  2kΩ  [RESC1005X06N]
X700  PSR400ITQFF0L50  [RESC10052X200N]

### Ports
EN (bidir, see 4[2B], 5[2A], 6[1C]), GPIO 14/Interrupt_Mikrobus (out, see 5[2B]), GPIO 15/PWM_Mikrobus (out, see 5[2B]), GPIO 18/CS_Mikrobus (in, see 5[2B]), GPIO 25/ALERT_INA (out, see 5[2B]), GPIO 26/Analogic_Mikrobus (in, see 5[1C]), GPIO 32/SCK (in, see 5[1C]), MISO/GPIO 19 (bidir, see 3[1C], 5[1B]), MOSI/GPIO 23 (bidir, see 3[1C], 5[1B]), SCL/GPIO 22 (bidir, see 5[1B], 7[1B], 7[1D]), SCL/GPIO 22 (bidir, see 5[1B], 7[1B], 7[4C]), SCL/GPIO 22 (bidir, see 5[1B], 7[1D], 7[4C]), SDA/GPIO 21 (bidir, see 5[1B], 7[1B], 7[1D]), SDA/GPIO 21 (bidir, see 5[1B], 7[1B], 7[4C]), SDA/GPIO 21 (bidir, see 5[1B], 7[1D], 7[4C]), U0RXD/RX_USB (bidir, see 5[1D], 6[2B]), U0TXD/TX_USB (out, see 5[1D], 6[2B])

### Nets
3V3: B700.6(VS) C701.1 J700.7 J701.3 J702.3 R701.1 R702.1 R703.2 R705.2 R706.1 R707.1
GND: B700.1(A1) B700.2(A0) B700.7(GND) C701.2 J700.8 J700.16 J701.4 J702.4
HT: B700.8(VBUS) P700.1 R700.2 X700.2
USB: J700.15
NetB301_3: J700.6 ; port MOSI/GPIO 23
NetB700_3: B700.3(ALERT) R703.1 ; port GPIO 25/ALERT_INA
NetB700_4: B700.4(SDA) J700.14 J701.2 J702.2 R702.2 R706.2 ; port SDA/GPIO 21
NetB700_5: B700.5(SCL) J700.13 J701.1 J702.1 R701.2 R707.2 ; port SCL/GPIO 22
NetB700_9: B700.9(IN-) C700.2 R704.1
NetB700_10: B700.10(IN+) C700.1 R700.1
NetJ700_1: J700.1 ; port GPIO 26/Analogic_Mikrobus
NetJ700_2: J700.2 ; port EN
NetJ700_3: J700.3 R705.1 ; port GPIO 18/CS_Mikrobus
NetJ700_4: J700.4 ; port GPIO 32/SCK
NetJ700_5: J700.5 ; port MISO/GPIO 19
NetJ700_9: J700.9 ; port GPIO 15/PWM_Mikrobus
NetJ700_10: J700.10 ; port GPIO 14/Interrupt_Mikrobus
NetJ700_11: J700.11 ; port U0RXD/RX_USB
NetJ700_12: J700.12 ; port U0TXD/TX_USB
NetP701_1: P701.1 R704.2 X700.1

Not connected (* = marked no-connect by the designer): J701 MP1* MP2*; J702 MP1* MP2*

### Notes on the sheet
- (near P700) Load +
- (near P701) Load -
- MikroBus
- (near J701) GROVE 1
- (near J702) GROVE 2
- Pull-up

### Library data of the parts
B700 = INA237AIDGST: Current Sense Amplifiers 85-V, 16-bit, I2C output current/voltage/power monitor with alert 10-VSSOP -40 to 125; Manufacturer_Name: Texas Instruments; Manufacturer_Part_Number: INA237AIDGST; Mouser Part Number: 595-INA237AIDGST
C700 C701 = Capacitor
J700 = Connect-Mikrobus: Headers & Wire Housings 8P double for connection mikrobus; Manufacturer_Name: TE Connectivity; Manufacturer_Part_Number: 825433-8; Mouser Part Number: 571-825433-8
J701 J702 = 114020164: Seeed Studio Accessories Grove Female Header - SMD-4P-2.0mm-90D-20Pcs; Manufacturer_Name: Seeed Studio; Manufacturer_Part_Number: 114020164; Mouser Part Number: 713-114020164
P700 P701 = Plage CMS 10x5: Plage de report CMS 10x5mm; PN: L30; Value: Plage CMS 10x5; Footprint_statut: ok
R700-R707 = Resistor
X700 = PSR400ITQFF0L50: ROHM - PSR400ITQFF0L50 - SMD Current Sense Resistor, 500 ohm, PSR Series, 3921 [1052 Metric], 4 W, +/- 1%, Metal Strip; Manufacturer_Name: ROHM Semiconductor; Geometry.Height: 2mm; Manufacturer_Part_Number: PSR400ITQFF0L50; Mouser Part Number: 755-PSR400ITQFF0L50; Mouser Price/Stock: https://www.mouser.co.uk/ProductDetail/ROHM-Semiconductor/PSR400ITQFF0L50?qs=493kPxzlxfLaT1w5Mo%252BtHg%3D%3D; Arrow Part Number: *; Arrow Price/Stock: *; Datasheet Link: https://componentsearchengine.com/Datasheets/2/PSR400ITQFF0L50.pdf

## Nets that join several sheets
3V3: Capteurs_et_Antenne (B301.6 C304.1 R300.1 R301.2), Logique_Prio_Alim (Q200.2 Q201.2 Q202.2), IHM (LS400.P R400.2 R401.2), ESP32_SRAM (9 pins), USB (U600.5 U600.6), I2C (11 pins)
3V3_BT: Converti_Alim (C104.2 DARR101.2 R102.2), Logique_Prio_Alim (B202.2 B203.3 Q201.3)
3V3_HT: Converti_Alim (C105.2 DARR100.2 R103.2), Logique_Prio_Alim (B201.1 Q200.3)
3V3_Logique: Converti_Alim (C110.1 DARR100.1 DARR101.1 DARR102.1), Logique_Prio_Alim (B200.5 B201.5 B202.5 B203.14)
3V3_USB: Converti_Alim (C109.2 DARR102.2 R107.2), Logique_Prio_Alim (B203.5 Q202.1 Q202.3)
GND: Capteurs_et_Antenne (6 pins), Converti_Alim (22 pins), Logique_Prio_Alim (B200.3 B201.3 B202.3 B203.7), IHM (6 pins), ESP32_SRAM (5 pins), USB (16 pins), I2C (8 pins)
HT: Converti_Alim (B100.4 B100.5 C101.1 J100.2), I2C (B700.8 P700.1 R700.2 X700.2)
USB: Converti_Alim (B102.5 C107.1 R104.1), USB (9 pins), I2C (J700.15)
NetB300_1: Capteurs_et_Antenne (B300.1 C303.1 R300.2), ESP32_SRAM (U500.10)
NetB301_1: Capteurs_et_Antenne (B301.1), ESP32_SRAM (U500.34)
NetB301_3: Capteurs_et_Antenne (B301.3 R302.2), ESP32_SRAM (U500.36), I2C (J700.6)
NetB301_4: Capteurs_et_Antenne (B301.4), ESP32_SRAM (U500.18)
NetB301_5: Capteurs_et_Antenne (B301.5 R301.1), ESP32_SRAM (U500.14)
NetB700_3: ESP32_SRAM (U500.25), I2C (B700.3 R703.1)
NetB700_4: ESP32_SRAM (U500.42), I2C (6 pins)
NetB700_5: ESP32_SRAM (U500.39), I2C (6 pins)
NetC300_2: Capteurs_et_Antenne (C300.2 C302.2), ESP32_SRAM (U500.2)
NetJ700_1: ESP32_SRAM (U500.15), I2C (J700.1)
NetJ700_2: IHM (SW400.2), ESP32_SRAM (U500.9), USB (Q601.3), I2C (J700.2)
NetJ700_3: ESP32_SRAM (U500.35), I2C (J700.3 R705.1)
NetJ700_4: ESP32_SRAM (U500.12), I2C (J700.4)
NetJ700_5: Capteurs_et_Antenne (R302.1), ESP32_SRAM (U500.38), I2C (J700.5)
NetJ700_9: ESP32_SRAM (U500.21), I2C (J700.9)
NetJ700_10: ESP32_SRAM (U500.17), I2C (J700.10)
NetJ700_11: ESP32_SRAM (U500.40), USB (R603.1), I2C (J700.11)
NetJ700_12: ESP32_SRAM (U500.41), USB (R604.1), I2C (J700.12)
NetQ600_3: IHM (SW401.1), ESP32_SRAM (U500.23), USB (Q600.3)
NetR402_1: IHM (R402.1), ESP32_SRAM (U500.20)
NetR403_1: IHM (R403.1), ESP32_SRAM (U500.22)
NetR404_1: IHM (R404.1), ESP32_SRAM (U500.24)

## Assembly variants
rev A: all parts fitted